# EAGLE schematic Ardiboard (EAGLE 6.6.0)
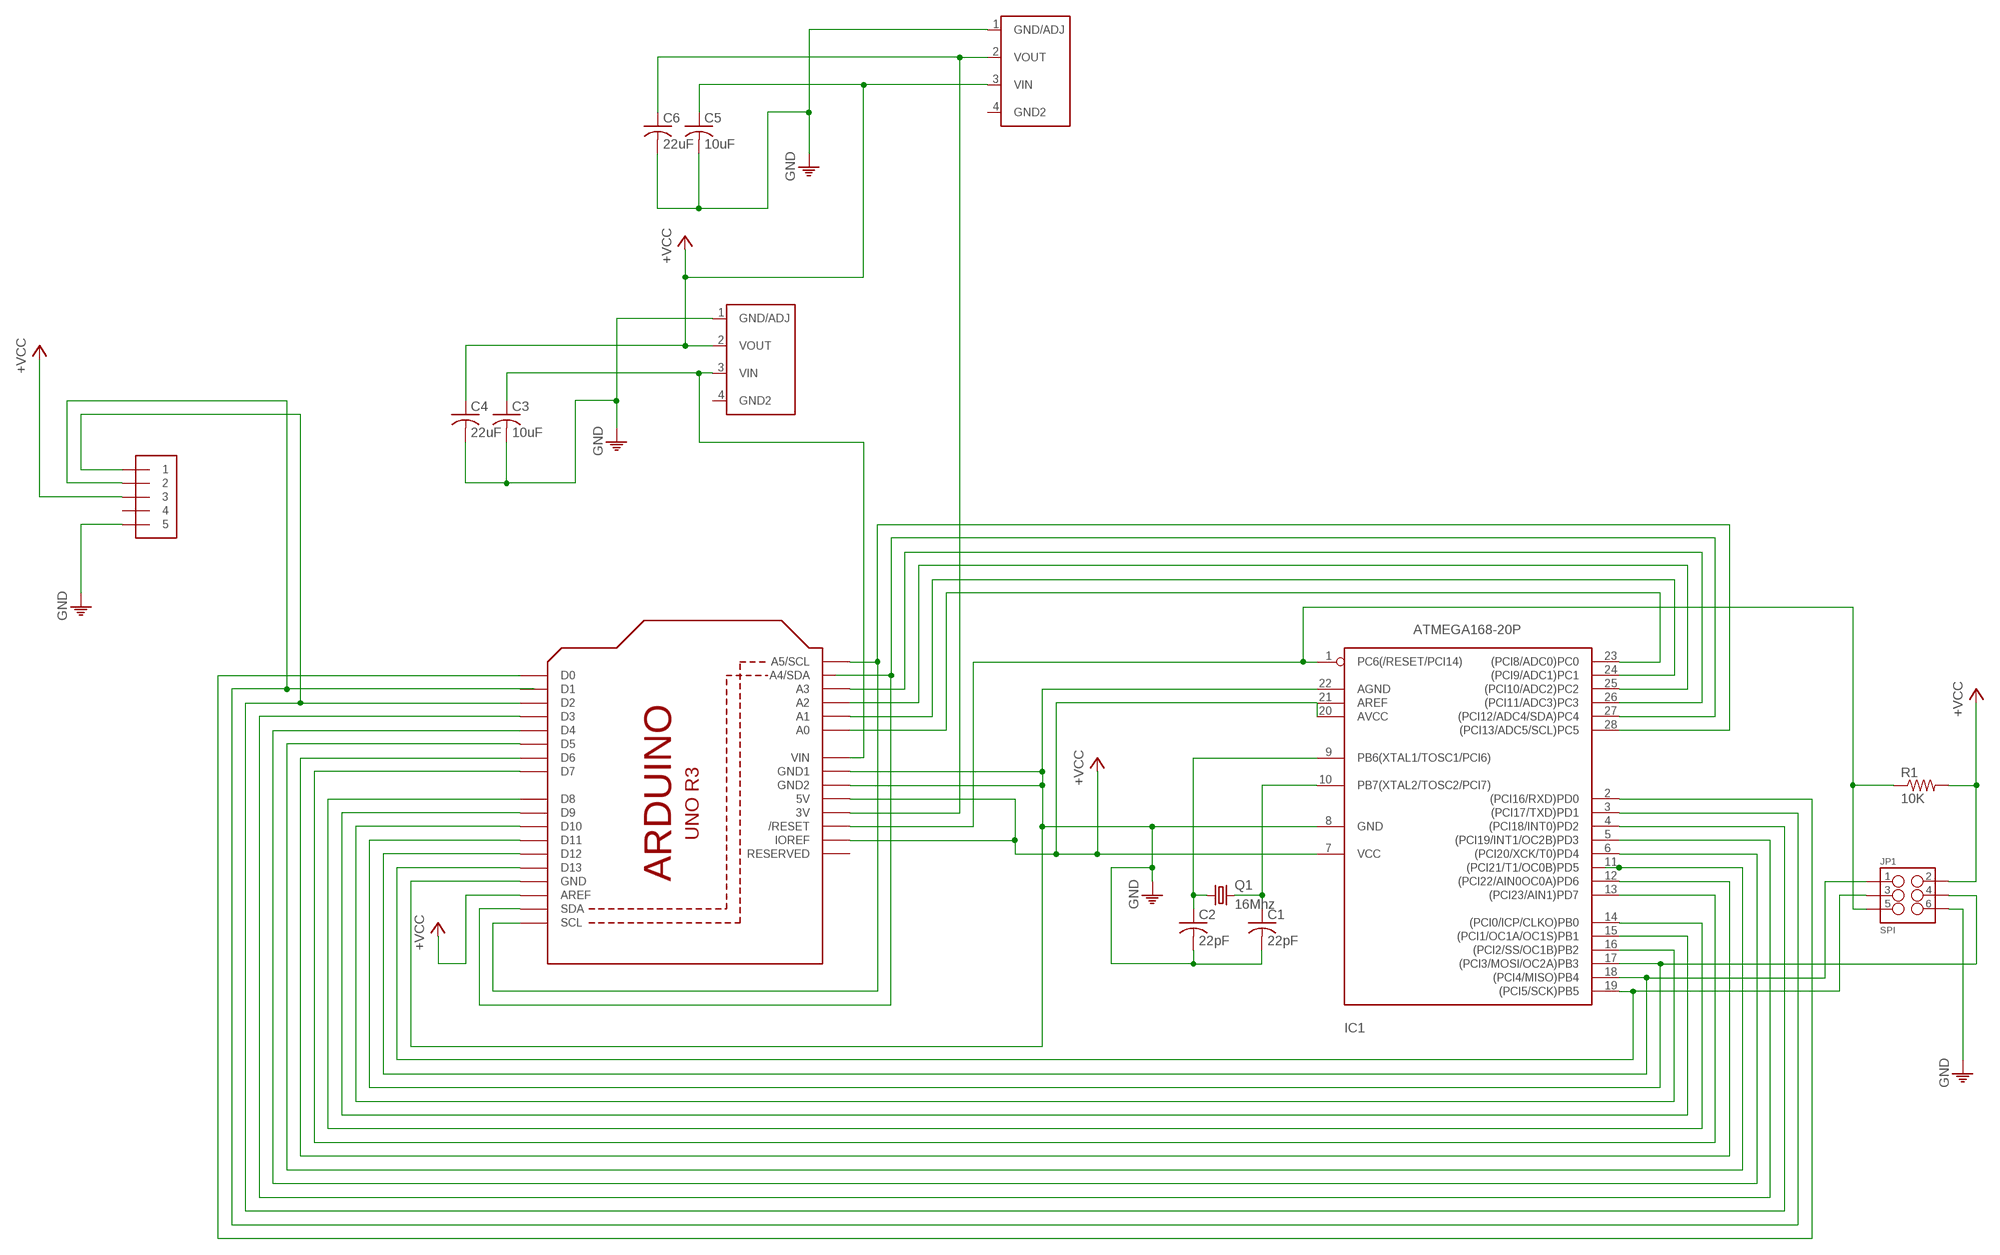
[diagram p0: schematic, sheet 1]

## Parts
C1  22pF  C-US025-025X050  [C025-025X050]
C2  22pF  C-US025-025X050  [C025-025X050]
C3  10uF  C-US025-030X050  [C025-030X050]
C4  22uF  C-US025-030X050  [C025-030X050]
C5  10uF  C-US025-030X050  [C025-030X050]
C6  22uF  C-US025-030X050  [C025-030X050]
IC1  ATMEGA168-20P  [DIL28-3]
J1  1X5  [1X05-3.5MM]
JP1  SPI  M03X2  [2X3-SHROUDED]
Q1  16Mhz  CRYSTALHC49S  [HC49/S]
Q2  AZ1086H-5.0  AZ1086-XX  [SOT223]
Q3  AZ1086H-3.3  AZ1086-XX  [SOT223]
R1  10K  R-US_0207/10  [0207/10]
U1  ARDUINOR3-BPLACE  [ARDUINOR3-BPLACE]

## Nets
+5V: C4.1 C5.1 IC1.7(VCC) IC1.20(AVCC) IC1.21(AREF) J1.3 JP1.2 Q2.2(VOUT) Q3.3(VIN) R1.2 U1.5V U1.AREF U1.IOREF ; supply symbol labelled +VCC
N$1: IC1.23((PCI8/ADC0)PC0) U1.A0
N$2: IC1.24((PCI9/ADC1)PC1) U1.A1
N$3: IC1.25((PCI10/ADC2)PC2) U1.A2
N$4: IC1.26((PCI11/ADC3)PC3) U1.A3
N$5: IC1.27((PCI12/ADC4/SDA)PC4) U1.SDA
N$6: IC1.28((PCI13/ADC5/SCL)PC5) U1.A5(A5/SCL) U1.SCL
N$7: IC1.19((PCI5/SCK)PB5) JP1.3 U1.D13
N$8: IC1.4((PCI18/INT0)PD2) J1.1 U1.D2
N$9: IC1.18((PCI4/MISO)PB4) JP1.1 U1.D12
N$10: IC1.17((PCI3/MOSI/OC2A)PB3) JP1.4 U1.D11
N$11: IC1.16((PCI2/SS/OC1B)PB2) U1.D10
N$12: IC1.15((PCI1/OC1A/OC1S)PB1) U1.D9
N$13: IC1.14((PCI0/ICP/CLKO)PB0) U1.D8
N$14: IC1.13((PCI23/AIN1)PD7) U1.D7
N$15: IC1.12((PCI22/AIN0OC0A)PD6) U1.D6
N$16: IC1.11((PCI21/T1/OC0B)PD5) U1.D5
N$17: IC1.6((PCI20/XCK/T0)PD4) U1.D4
N$18: IC1.5((PCI19/INT1/OC2B)PD3) U1.D3
N$19: IC1.3((PCI17/TXD)PD1) J1.2
N$20: C1.1 IC1.10(PB7(XTAL2/TOSC2/PCI7)) Q1.2
N$21: IC1.2((PCI16/RXD)PD0) U1.D0
N$22: IC1.1(PC6(/RESET/PCI14)) JP1.5 R1.1 U1.RESET(/RESET)
N$23: C2.1 IC1.9(PB6(XTAL1/TOSC1/PCI6)) Q1.1
N$24: C6.1 Q3.2(VOUT) U1.3V
N$25: C3.1 Q2.3(VIN) U1.VIN
PE: C1.2 C2.2 C3.2 C4.2 C5.2 C6.2 IC1.8(GND) IC1.22(AGND) J1.5 JP1.6 Q2.1(GND/ADJ) Q3.1(GND/ADJ) U1.GND U1.GND1 U1.GND2 ; supply symbol labelled GND
Unconnected: J1.4 Q2.4(GND2) Q3.4(GND2) U1.A4(A4/SDA) U1.D1 U1.RESERVED

## Library data of the parts
C1-C6 = rcl:C-US: CAPACITOR, American symbol
IC1 = adafruit:ATMEGA168*P: MICROCONTROLLER 16 kBytes FLASH 1 kBytes SRAM 512 Bytes EEPROM USART 8-channel 10 bit ADC
J1 = adafruit:1X5
JP1 = SparkFun-Connectors:M03X2: 2x3 .1" header. Shrouded, with keying- CONN-10681 SMT- CONN-11415 Pogo pins- HW-11044; PROD_ID: CONN-10681
Q1 = adafruit:CRYSTAL: CRYSTAL; OC_FARNELL: 1667008; OC_NEWARK: unknown
Q2 Q3 = voltage:AZ1086-XX
R1 = rcl:R-US_: RESISTOR, American symbol
U1 = adafruit:ARDUINOR3: This is a new object for the new Arduino R3 - with extra pins that you may want to use (such as IOref, and duplicated A4/A5